# EAGLE design Tiny45Resetter (EAGLE 5.10)
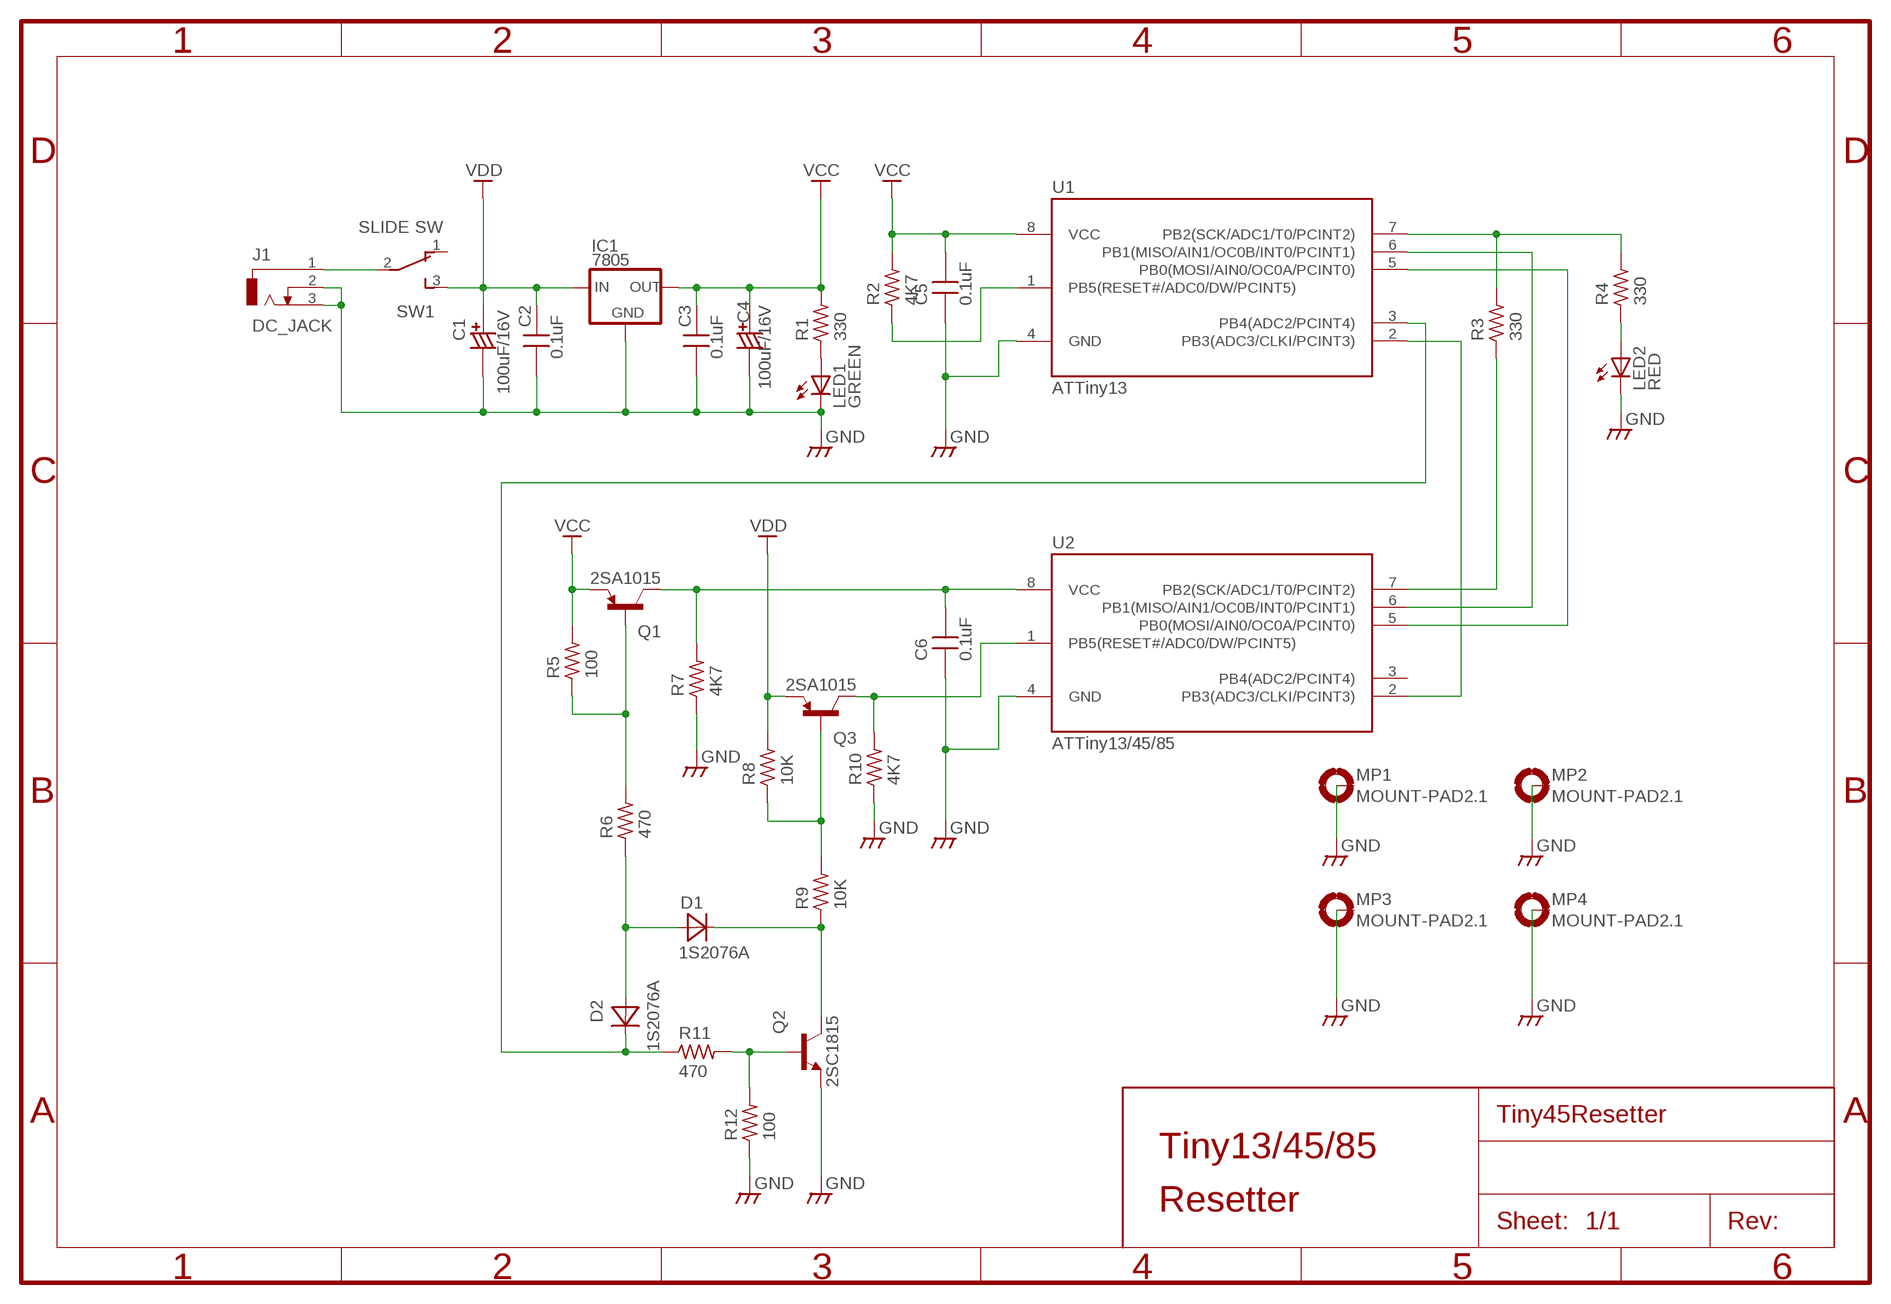
[diagram p0: schematic, sheet 1]

## Parts
C1  100uF/16V  CCAP6.5  [CCAP_6.5]
C2  0.1uF  CAPDIP_1  [CAP_DIP_1]
C3  0.1uF  CAPDIP_1  [CAP_DIP_1]
C4  100uF/16V  CCAP6.5  [CCAP_6.5]
C5  0.1uF  CAPDIP_1  [CAP_DIP_1]
C6  0.1uF  CAPDIP_1  [CAP_DIP_1]
D1  1S2076A  DIODEGENERIC_2  [DIODE_2]
D2  1S2076A  DIODEGENERIC_2  [DIODE_2]
IC1  7805  7805HORIZ  [TO220H]
J1  DC_JACK  [DCJ0202]
LED1  GREEN  LED3MM  [LED3MM]
LED2  RED  LED3MM  [LED3MM]
MP1  MOUNT-PAD2.1  [PAD-2.1]
MP2  MOUNT-PAD2.1  [PAD-2.1]
MP3  MOUNT-PAD2.1  [PAD-2.1]
MP4  MOUNT-PAD2.1  [PAD-2.1]
Q1  2SA1015  [TO92]
Q2  2SC1815  [TO92]
Q3  2SA1015  [TO92]
R1  330  R0.125W_3P  [R_0.125W_3]
R2  4K7  R0.125W_3P  [R_0.125W_3]
R3  330  R0.125W_3P  [R_0.125W_3]
R4  330  R0.125W_3P  [R_0.125W_3]
R5  100  R0.125W_3P  [R_0.125W_3]
R6  470  R0.125W_3P  [R_0.125W_3]
R7  4K7  R0.125W_3P  [R_0.125W_3]
R8  10K  R0.125W_3P  [R_0.125W_3]
R9  10K  R0.125W_3P  [R_0.125W_3]
R10  4K7  R0.125W_3P  [R_0.125W_3]
R11  470  R0.125W_3P  [R_0.125W_3]
R12  100  R0.125W_3P  [R_0.125W_3]
SW1  SLIDE SW  SLIDESW-3  [DS-3]
U1  ATTiny13  TINY138P3  [DIL08]
U2  ATTiny13/45/85  TINY138P3  [DIL08]

## Nets
GND: C1.- C2.1 C3.1 C4.- C5.1 C6.1 IC1.2(GND) J1.2 J1.3 LED1.K(C) LED2.K(C) MP1.B2,1(MOUNT) MP2.B2,1(MOUNT) MP3.B2,1(MOUNT) MP4.B2,1(MOUNT) Q2.E R7.1 R10.1 R12.1 U1.4(GND) U2.4(GND)
N$1: U1.2(PB3(ADC3/CLKI/PCINT3)) U2.2(PB3(ADC3/CLKI/PCINT3))
N$2: R3.2 R4.2 U1.7(PB2(SCK/ADC1/T0/PCINT2))
N$3: R3.1 U2.7(PB2(SCK/ADC1/T0/PCINT2))
N$4: U1.6(PB1(MISO/AIN1/OC0B/INT0/PCINT1)) U2.6(PB1(MISO/AIN1/OC0B/INT0/PCINT1))
N$5: LED2.A R4.1
N$6: U1.5(PB0(MOSI/AIN0/OC0A/PCINT0)) U2.5(PB0(MOSI/AIN0/OC0A/PCINT0))
N$7: R2.1 U1.1(PB5(RESET#/ADC0/DW/PCINT5))
N$8: C6.2 Q1.C R7.2 U2.8(VCC)
N$9: J1.1 SW1.2(P)
N$10: LED1.A R1.1
N$11: Q1.B R5.1 R6.2
N$12: Q3.C R10.2 U2.1(PB5(RESET#/ADC0/DW/PCINT5))
N$13: Q3.B R8.1 R9.2
N$14: Q2.B R11.2 R12.2
N$15: D1.K Q2.C R9.1
N$16: D2.K R11.1 U1.3(PB4(ADC2/PCINT4))
N$17: D1.A D2.A R6.1
VCC: C3.2 C4.+ C5.2 IC1.3(OUT) Q1.E R1.2 R2.2 R5.2 U1.8(VCC)
VDD: C1.+ C2.2 IC1.1(IN) Q3.E R8.2 SW1.3(S)
Unconnected: SW1.1(O) U2.3(PB4(ADC2/PCINT4))

## Notes on the sheet
- Tiny13/45/85
- Resetter

## Library data of the parts
C1 C4 = MyLib:CCAP: Polar capacitor
C2 C3 C5 C6 = MyLib:CAP: Non polar capacitor
D1 D2 = MyLib:DIODE: General Use Diode
IC1 = MyLib:78*
J1 = MyLib:DC_JACK: DC Jack with Switch
LED1 LED2 = led:LED: LED OSRAM: - CHIPLED LG R971, LG N971, LY N971, LG Q971, LY Q971, LO R971, LY R971 LH N974, LH R974 LS Q976, LO Q976, LY Q976 LO Q996 - Hyper CHIPLED LW Q18S LB Q993, LB Q99A, LB R99A - SideLED LS A670, LO A670, LY A670, LG A670, LP A670 LB A673, LV A673, LT A673, LW A673 LH A674 LY A675 LS A676, LA A676, LO A676, LY A676, LW A676 LS A679, LY A679, LG A679 - Hyper Micro SIDELEDR LS Y876, LA Y876, LO Y876, LY Y876 LT Y87S - SmartLED LW L88C, LW L88S LB L89C, LB L89S, LG L890 LS L89K, LO L89K, LY L89K LS L896, LA L896, LO L896, LY L896 - TOPLED LS T670, LO T670, LY T670, LG T670, LP T670 LSG T670, LSP T670, LSY T670, LOP T670, LYG T670 LG T671, LOG T671, LSG T671 LB T673, LV T673, LT T673, LW T673 LH T674 LS T676, LA T676, LO T676, LY T676, LB T676, LH T676, LSB T676, LW T676 LB T67C, LV T67C, LT T67C, LS T67K, LO T67K, LY T67K, LW E67C LS E67B, LA E67B, LO E67B, LY E67B, LB E67C, LV E67C, LT E67C LW T67C LS T679, LY T679, LG T679 LS T770, LO T770, LY T770, LG T770, LP T770 LB T773, LV T773, LT T773, LW T773 LH T774 LS E675, LA E675, LY E675, LS T675 LS T776, LA T776, LO T776, LY T776, LB T776 LHGB T686 LT T68C, LB T68C - Hyper Mini TOPLEDR LB M676 - Mini TOPLED SantanaR LG M470 LS M47K, LO M47K, LY M47K Source: http://www.osram.convergy.de LUXEON: - LUMILEDR LXK2-PW12-R00, LXK2-PW12-S00, LXK2-PW14-U00, LXK2-PW14-V00 LXK2-PM12-R00, LXK2-PM12-S00, LXK2-PM14-U00 LXK2-PE12-Q00, LXK2-PE12-R00, LXK2-PE12-S00, LXK2-PE14-T00, LXK2-PE14-U00 LXK2-PB12-K00, LXK2-PB12-L00, LXK2-PB12-M00, LXK2-PB14-N00, LXK2-PB14-P00, LXK2-PB14-Q00 LXK2-PR12-L00, LXK2-PR12-M00, LXK2-PR14-Q00, LXK2-PR14-R00 LXK2-PD12-Q00, LXK2-PD12-R00, LXK2-PD12-S00 LXK2-PH12-R00, LXK2-PH12-S00 LXK2-PL12-P00, LXK2-PL12-Q00, LXK2-PL12-R00 Source: www.luxeon.com KINGBRIGHT: KA-3528ASYC Source: www.kingbright.com
MP1-MP4 = MyLib:MOUNT-PAD: 2.1mm Mount Pad (Connectable to GND)
Q1 Q3 = MyLib:2SA1015: General PNP Transistor
Q2 = MyLib:2SC1815: General use NPN transistor
R1-R12 = MyLib:R: General Resiter 1/8W 1/4W 1/2W V/H
SW1 = MyLib:SLIDESW-3: 3P Slide Switch
U1 U2 = atmel:TINY13*

## Board
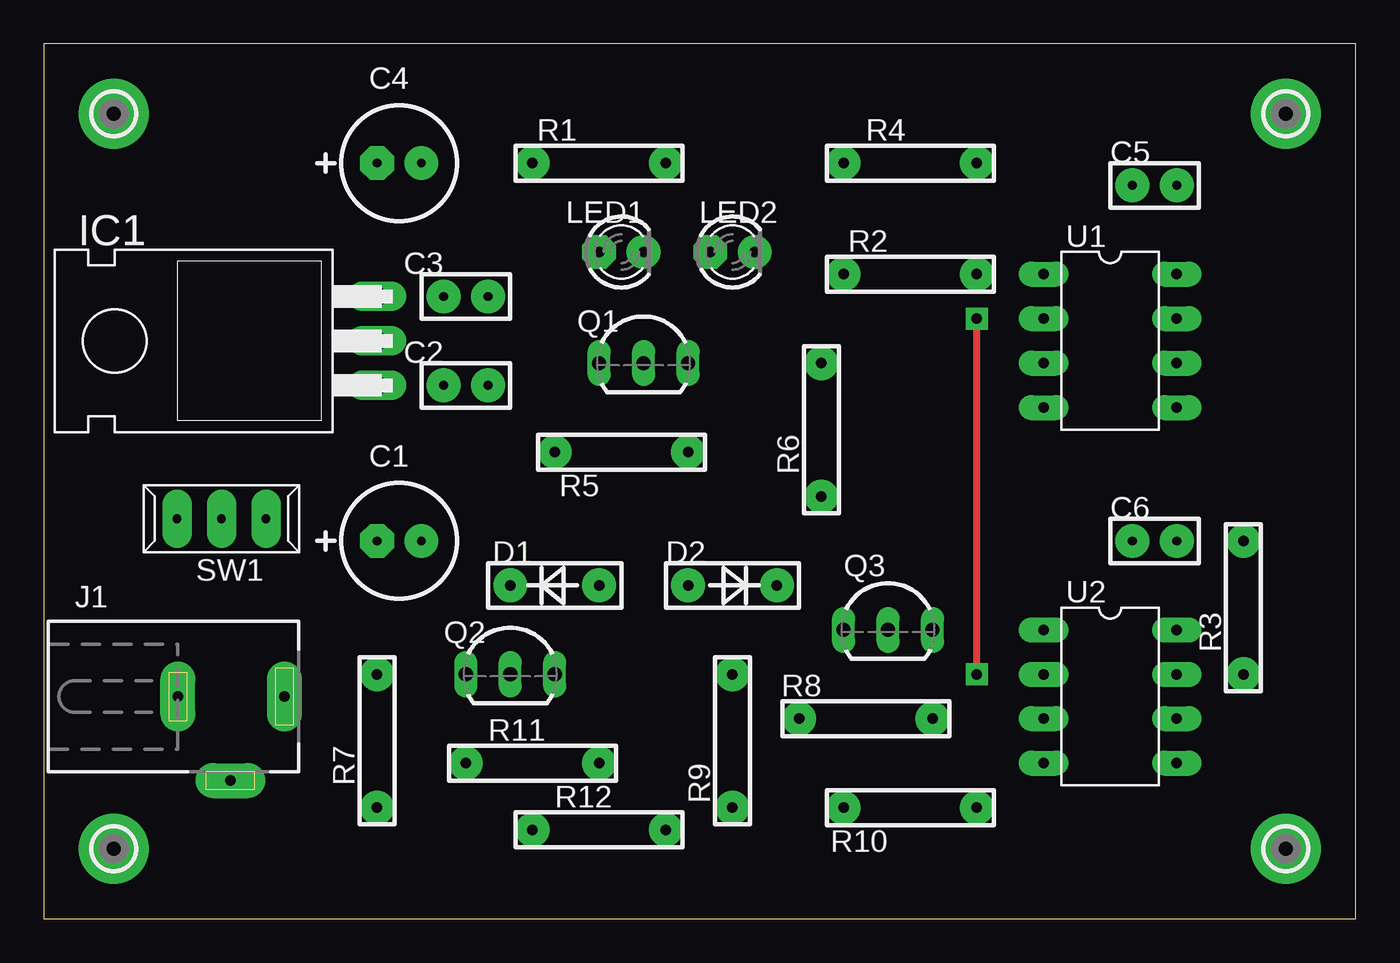
[diagram p1: board, top side]
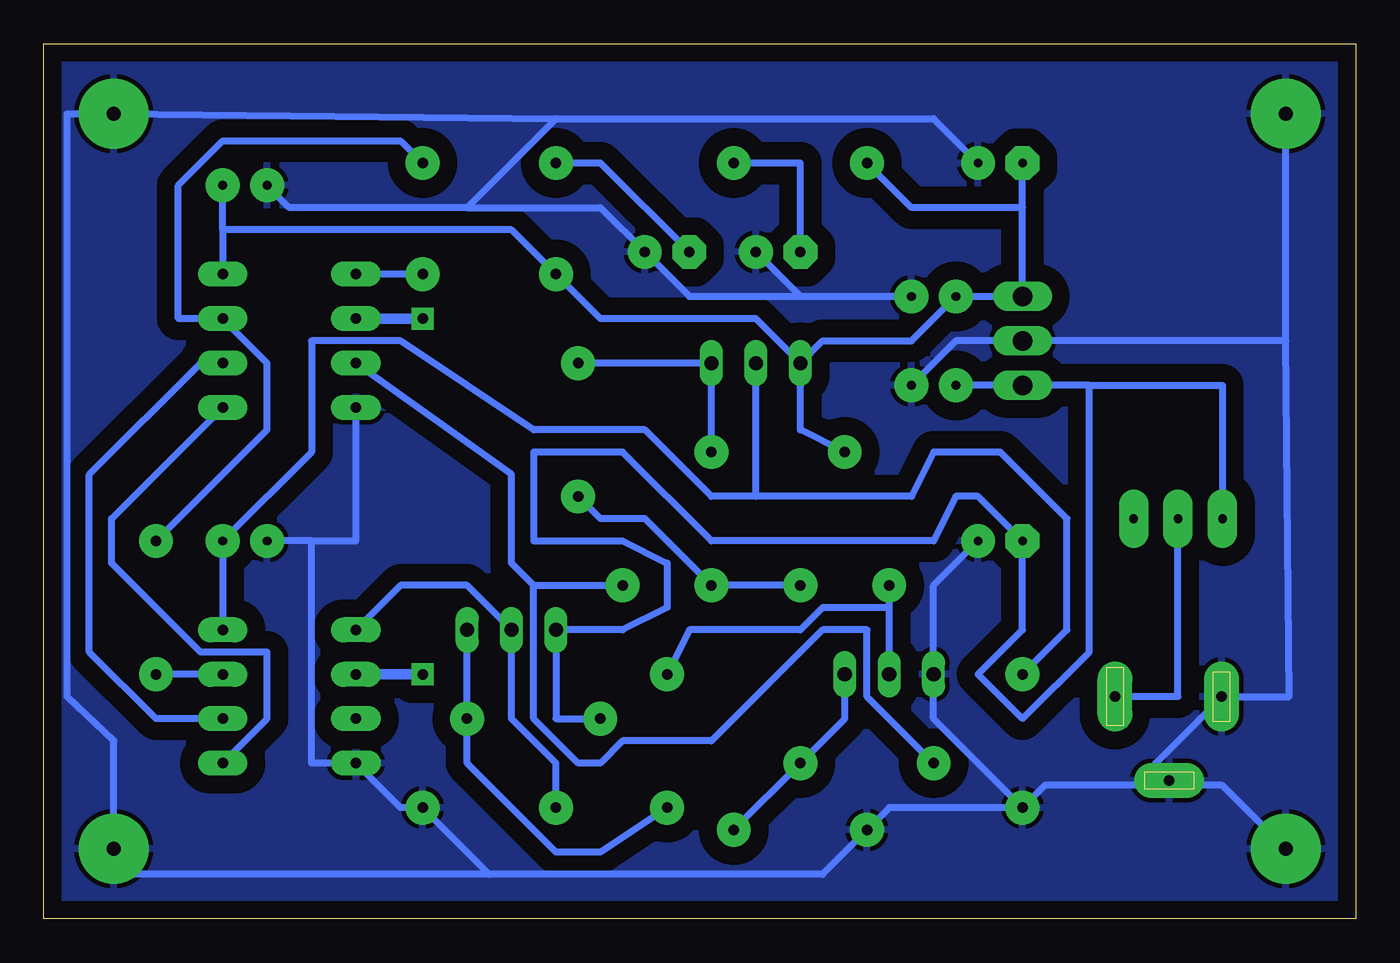
[diagram p2: board, bottom side, seen from below]

Size 75 x 50 mm. Coordinates in mm from the lower left corner, seen from the top.
Outline: 0,0 75,0 75,50 0,50 0,0
Copper layers (1*16): Top 0.035mm / dielectric 1.5mm / Bottom 0.035mm
Design rules "default": minimum track width 10mil, minimum drill 24mil, track to track 8mil, track to pad 8mil, pad to pad 8mil, via to via 8mil, smd to smd 8mil, copper to edge 40mil, drill to drill 8mil, minimum pad ring 10mil, minimum via ring 8mil, stop-mask expansion 4mil, vias tented up to drill 0mil, thermal gap 10mil

### Footprints (pad centres in the part's own frame; a part is rotated, then mirrored left to right if it is on the bottom)
CCAP_6.5 = drill 0.5 pad 1.93 octagon: + -1.27,0 | drill 0.5 pad 1.93 round: - 1.27,0
CAP_DIP_1 = drill 0.5 pad 1.93 round: 1 -1.27,0; 2 1.27,0
DIODE_2 = drill 0.6 pad 1.93 round: A -2.54,0; K 2.54,0
TO220H = drill 1.118 long: 1 -2.54,-7.62; 2 0,-7.62; 3 2.54,-7.62
DCJ0202 = drill 0.6 pad 2 long: 1 0,6.148; 2 4.8,3.048; 3 0,0.048
LED3MM = drill 0.6 pad 1.93 octagon: A -1.27,0 | drill 0.6 pad 1.93 round: K 1.27,0
PAD-2.1 = drill 0.8 pad 4 round: B2,1 0,0
TO92 = drill 0.813 long: B 2.54,0; C 0,0; E -2.54,0
R_0.125W_3 = drill 0.6 pad 1.93 round: 1 -3.81,0; 2 3.81,0
DS-3 = drill 0.5 pad 1.676 long: 1 0,-2.54; 2 0,0; 3 0,2.54
DIL08 = drill 0.6 pad 1.422 long: 1 -3.81,-3.81; 2 -1.27,-3.81; 3 1.27,-3.81; 4 3.81,-3.81; 5 3.81,3.81; 6 1.27,3.81; 7 -1.27,3.81; 8 -3.81,3.81

### Placement (x,y rotation side)
C1  20.32,21.59 0 top
C2  24.13,30.48 180 top
C3  24.13,35.56 180 top
C4  20.32,43.18 0 top
C5  63.5,41.91 0 top
C6  63.5,21.59 0 top
D1  29.21,19.05 180 top
D2  39.37,19.05 0 top
IC1  11.43,33.02 90 top
J1  7.62,12.7 270 top
LED1  33.02,38.1 0 top
LED2  39.37,38.1 0 top
MP1  4,4 0 top
MP2  71,4 0 top
MP3  71,46 0 top
MP4  4,46 0 top
Q1  34.29,31.75 0 top
Q2  26.67,13.97 0 top
Q3  48.26,16.51 0 top
R1  31.75,43.18 180 top
R2  49.53,36.83 180 top
R3  68.58,17.78 90 top
R4  49.53,43.18 0 top
R5  33.02,26.67 180 top
R6  44.45,27.94 90 top
R7  19.05,10.16 90 top
R8  46.99,11.43 180 top
R9  39.37,10.16 270 top
R10  49.53,6.35 180 top
R11  27.94,8.89 0 top
R12  31.75,5.08 0 top
SW1  10.16,22.86 90 top
U1  60.96,33.02 270 top
U2  60.96,12.7 270 top

### Tracks (layer width: path | path; a pad name or v marks a point on that pad's centre or on a via)
GND
  Bottom 0.254: 11.43,8.89 J1.2 10.16,7.62 | 7.62,12.7 J1.3
  Bottom 0.406: C2.1 22.86,33.02 IC1.2 4,33.02 | 31.75,35.56 C3.1 | 31.75,35.56 LED1.K | 31.75,35.56 38.1,35.56 LED2.K 43.18,40.64 50.8,40.64 | C5.1 60.96,40.64 50.8,40.64 | 45.72,45.72 24.13,45.72 C4.- | 45.72,45.72 50.8,40.64 | U1.4 57.15,21.59 59.69,21.59 | 59.69,21.59 C6.1 | 59.69,21.59 59.69,8.89 U2.4 54.61,6.35 R10.1 49.53,2.54 | C1.- 24.13,19.05 Q2.E 24.13,11.43 R7.1 | R7.1 17.78,7.62 11.43,7.62 J1.2 | R7.1 26.67,6.35 R12.1 30.48,2.54 49.53,2.54 | 11.43,8.89 7.62,12.7 3.81,12.7 4,33.02 | MP1.B2,1 7.62,7.62 10.16,7.62 | 45.72,45.72 MP3.B2,1 73.66,46 73.66,12.7 71,10.16 MP2.B2,1 69.85,2.54 49.53,2.54 | 4,33.02 MP4.B2,1
  pour Bottom (isolate 1.016): 0,50.8 0,0 74.93,0 74.93,50.8
N$1  (via drill 0.6 pad 1.27)
  Top 0.406: v53.34,13.97 v53.34,34.29
  Bottom 0.61: v53.34,34.29 U1.2 | v53.34,13.97 U2.2
N$2
  Bottom 0.406: R3.2 62.23,27.94 62.23,31.75 U1.7 67.31,34.29 67.31,41.91 64.77,44.45 54.61,44.45 R4.2
N$3
  Bottom 0.406: U2.7 R3.1
N$4
  Bottom 0.406: U2.6 68.58,11.43 72.39,15.24 72.39,25.4 66.04,31.75 U1.6
N$5
  Bottom 0.406: LED2.A 43.18,43.18 R4.1
N$6
  Bottom 0.406: U2.5 62.23,11.43 62.23,15.24 66.04,15.24 71.12,20.32 71.12,22.86 U1.5
N$7
  Bottom 0.406: R2.1 U1.1
N$8
  Bottom 0.406: U2.8 C6.2 59.69,26.67 59.69,33.02 54.61,33.02 46.99,27.94 40.64,27.94 36.83,24.13 34.29,24.13 | 34.29,24.13 Q1.C | 34.29,24.13 25.4,24.13 24.13,26.67 20.32,26.67 16.51,22.86 16.51,16.51 R7.2
N$9
  Bottom 0.254: J1.1 13.97,12.7
  Bottom 0.406: SW1.2 10.16,12.7 J1.1
N$10
  Bottom 0.406: LED1.A 31.75,43.18 R1.1
N$11
  Bottom 0.406: R5.1 Q1.B R6.2
N$12
  Bottom 0.406: U2.1 54.61,19.05 50.8,19.05 Q3.C 48.26,11.43 45.72,8.89 R10.2
N$13
  Bottom 0.406: Q3.B R8.1 50.8,8.89 45.72,3.81 43.18,3.81 R9.2
N$14
  Bottom 0.406: Q2.B 29.21,11.43 R11.2 R12.2
N$15
  Bottom 0.406: 26.67,17.78 D1.K | Q2.C 26.67,17.78 | R9.1 38.1,16.51 31.75,16.51 30.48,17.78 26.67,17.78
N$16
  Bottom 0.406: U1.3 48.26,25.4 48.26,20.32 46.99,19.05 | 46.99,19.05 D2.K | R11.1 27.94,12.7 27.94,16.51 30.48,16.51 36.83,10.16 41.91,10.16 43.18,8.89 44.45,8.89 46.99,11.43 46.99,19.05
N$17
  Bottom 0.406: D1.A D2.A 40.64,22.86 43.18,22.86 R6.1
VCC
  Bottom 0.406: 64.77,39.37 C5.2 | 64.77,39.37 U1.8 | 64.77,39.37 48.26,39.37 R2.2 43.18,34.29 34.29,34.29 Q1.E | Q1.E 31.75,27.94 R5.2 | 19.05,40.64 IC1.3 C3.2 25.4,33.02 30.48,33.02 Q1.E | R1.2 25.4,40.64 19.05,40.64 | 19.05,40.64 C4.+
VDD
  Bottom 0.406: R8.2 45.72,11.43 Q3.E 41.91,16.51 39.37,17.78 39.37,20.32 41.91,21.59 46.99,21.59 46.99,26.67 41.91,26.67 36.83,21.59 24.13,21.59 22.86,24.13 21.59,24.13 C1.+ 19.05,16.51 21.59,13.97 19.05,11.43 15.24,15.24 15.24,30.48 | 15.24,30.48 7.62,30.48 SW1.3 | 15.24,30.48 IC1.1 C2.2